# Altium project FC_Ver_0_1.PrjPcb
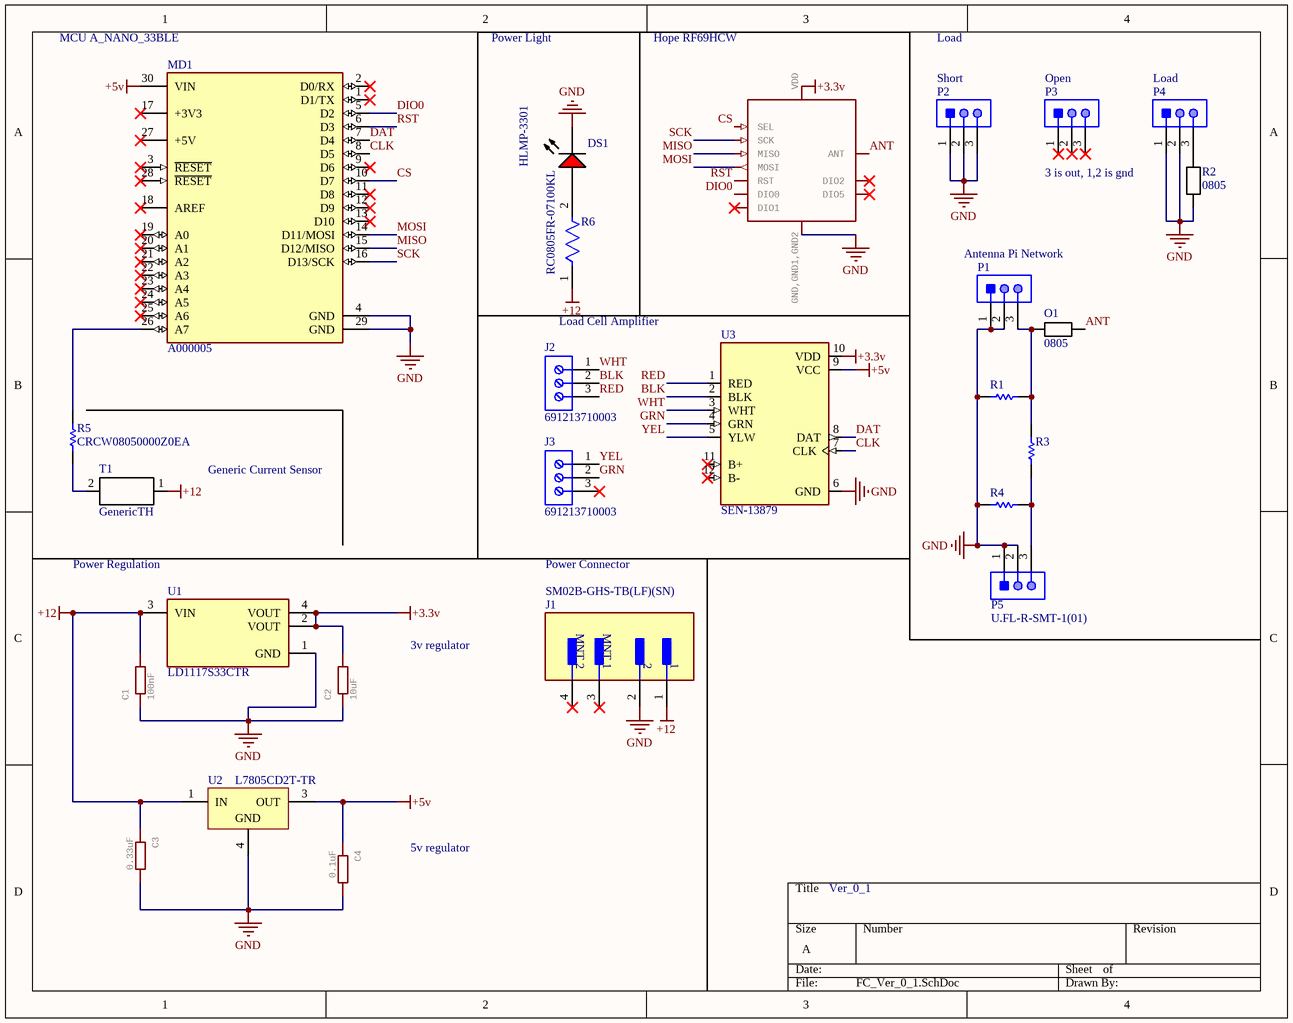
[diagram p0: FC_Ver_0_1.SchDoc]
1 sheet, 26 parts. Net scope: global (net labels, ports and power ports of the same name join across sheets).
Board file: FC_Ver_0_1.PcbDoc

## Sheet FC_Ver_0_1.SchDoc
size A; SheetNumber: 1; SheetTotal: 1

### Parts
1  _C2H_RFM95  [_C2H_RFM95]  (value not drawn)
C1  100nF  [RCL_M0805]
C2  10uF  [RCL_M0805]
C3  0.33uF  [RCL_M0805]
C4  0.1uF  [RCL_M0805]
DS1  HLMP-3301  [AVAG-HLMP-3301-2]
J1  SM02B-GHS-TB(LF)(SN)  [FP-SM02B-GHS-TB_LF_SN-MFG]
J2  691213710003  [691213710003]
J3  691213710003  [691213710003]
MD1  A000005  [FP-A000005-MFG]
O1  0805  [RESC2012X06N]
P1  U.FL-R-SMT-1(01)  [HRS-U.FL-R-SMT-3_V]  (value not drawn)
P2  Short  [HRS-U.FL-R-SMT-3_V]
P3  Open  [HRS-U.FL-R-SMT-3_V]
P4  Load  [HRS-U.FL-R-SMT-3_V]
P5  U.FL-R-SMT-1(01)  [HRS-U.FL-R-SMT-3_V]
R1  RC0805FR-071KL  [RESC2013X60X35ML10T20]  (value not drawn)
R2  0805  [RESC2012X06N]
R3  RC0805FR-071KL  [RESC2013X60X35ML10T20]  (value not drawn)
R4  RC0805FR-071KL  [RESC2013X60X35ML10T20]  (value not drawn)
R5  CRCW08050000Z0EA  [RESC2013X50X30LL20T20]
R6  RC0805FR-07100KL  [FP-RC0805-0_6-IPC_C]
T1  GenericTH  [Generic Two Pin Connector]
U1  LD1117S33CTR  [FP-SOT-223-0046067_14-MFG]
U2  L7805CD2T-TR  [TO-263_M]
U3  SEN-13879  [SPARKFUN_SEN-13879]

### Nets
+3.3v: 1.VDD(VCC) C2.2 U1.2(VOUT) U1.4(VOUT) U3.10(VDD)
+5v: C4.1 MD1.30(VIN) U2.3(OUT) U3.9(VCC)
+12: C1.2 C3.1 J1.1 R6.1 T1.1 U1.3(VIN) U2.1(IN)
GND: 1.GND,GND1,GND2(GND) C1.1 C2.1 C3.2 C4.2 DS1.1(K) J1.2 MD1.4(GND) MD1.29(GND) P1.1 P1.2 P2.1 P2.2 P2.3 P4.1 P4.2 P5.1 P5.2 R1.2 R2.1 R4.1 U1.1(GND) U2.4(GND) U3.6(GND)
ANT: 1.ANT O1.2
BLK: J2.2 U3.2(BLK)
CLK: MD1.8(D5) U3.7(CLK)
CS: 1.NSS(SEL) MD1.10(D7)
DAT: MD1.7(D4) U3.8(DAT)
DIO0: 1.DIO0 MD1.5(D2)
GRN: J3.2 U3.4(GRN)
MISO: 1.MISO MD1.15(D12/MISO)
MOSI: 1.MOSI MD1.14(D11/MOSI)
RED: J2.3 U3.1(RED)
RST: 1.RST MD1.6(D3)
SCK: 1.SCK MD1.16(D13/SCK)
WHT: J2.1 U3.3(WHT)
YEL: J3.1 U3.5(YLW)
NetDS1_2: DS1.2(A) R6.2
NetMD1_26: MD1.26(A7) R5.1
NetO1_1: O1.1 P1.3 R1.1 R3.2
NetP4_3: P4.3 R2.2
NetP5_3: P5.3 R3.1 R4.2
NetR5_2: R5.2 T1.2

Not connected (* = marked no-connect by the designer): 1 DIO1* DIO2* DIO5*; J1 3(MNT_1)* 4(MNT_2)*; J3 3*; MD1 1(D1/TX)* 2(D0/RX)* 3(~{RESET})* 9(D6)* 11(D8)* 12(D9)* 13(D10)* 17(+3V3)* 18(AREF)* 19(A0)* 20(A1)* 21(A2)* 22(A3)* 23(A4)* 24(A5)* 25(A6)* 27(+5V)* 28(~{RESET})*; P3 1* 2* 3*; U3 11(B+)* 12(B-)*

### Notes on the sheet
- (near MD1) MCU A_NANO_33BLE
- Power Light
- Hope RF69HCW
- Load
- 3 is out, 1,2 is gnd
- (near P1) Antenna Pi Network
- Load Cell Amplifier
- Generic Current Sensor
- (near U1) Power Regulation
- Power Connector
- 3v regulator
- 5v regulator
- Ver_0_1

### Library data of the parts
1 = _C2H_RFM95: GateName_1: G$1; SymbolName_1: _C2H_RFM95; LibraryName: AmbaSat-1v1-01-NO-solar; DeviceSetName: _C2H_RFM95; Package: _C2H_RFM95
C1-C4 = RCL_R-EU_M0805: GateName_1: G$1; DeviceName: M0805; SymbolName_1: RCL_R-EU; LibraryName: AmbaSat-1v1-01-NO-solar; DeviceSetName: RCL_R-EU_; Package: RCL_M0805
DS1 = CMP-2000-06411-1: T-1 3/4 (5 mm) Diffused LED Lamp, 1.9 V, -40 to 100 degC, 2-Pin THD, RoHS, Bulk; Manufacturer: Avago; Forward Current: 25mA; Forward Voltage: 2.4V; Peak Wavelength: 635nm; Shape Type: Circular; High Brightness: No; Main Category: StandardLED; Test Current (It): 10mA; Dominant Wave Length: 626nm; Number of  Elements: 1; Reverse Voltage: 5V; Chip Material: GaP; Product Height (mm): 9.19mm; Lens Type: ColoredDiffused; Viewing Angle: 60deg; Type: Uni-Color; Emitting Color: Red; Luminous Intensity: 5.4mcd; Power Dissipation: 85W; DELETED: Compliant; Product Depth (mm): 6.1mm; Package Description: 2-Pin Through Hole LED, Dia 5.85 mm; Mounting Technology: ThroughHole; Manufacturer URL: http://www.avagotech.com/; Package Type: T-13/4; Operating Temp Range: -40Cto100C; Datasheet URL: http://www.avagotech.com/docs/AV02-1558EN; Mounting: ThroughHole; Lens Dimensions: 5.08x5.08x8.3mm; Package Reference: HLMP-3301; Datasheet Version: 03/2015; Pin Count: 2; Packaging: TapeandReel; Operating Temperature Classification: Industrial; Lum Intensity: 5.4mcd; Rad Hardened: No; Product Length (mm): 6.1mm
J1 = CMP-2000-07076-2: CONN HEADER SMD R/A 2POS 1.25MM; Voltage Rating: 50V; Number of Positions: 2; Pitch: 0.049inch; Current Rating: 1A; Connector Type: Outer Shroud Contact; Number of Rows: 1; Contact Material: Bronze; Termination: Solder; Color: Natural; Package Quantity: 2500; Mount: Surface Mount; Housing Color: Natural; Number of Contacts: 2; Packaging: Tape and Reel; Lead Free: Lead Free; Housing Material: Nylon; Orientation: Right Angle; Contact Type: Male Pin; Contact Plating: Tin; Series: GH; Fastening Type: Latch
J2 J3 = CMP-1502-02527-2: NexarPartId: 8917719; Number of Contacts: 3; Wire/Cable Gauge: 16AWG; Wire Gauge (Max): 26AWG; Connector Type: PCB, Terminal Block; Number of Levels: 1; Plating: Brass, Steel; Current: 10A; Voltage: 300V; Stripping Length: -7mm; Pitch: 5.0038mm; REACH SVHC: Unknown; Mount: Through Hole; Max Operating Temperature: 105°C; Contact Plating: Tin; Termination: Screw; Contact Material: Brass; Housing Material: Nylon; Color: Green; RoHS: Compliant; Wire Gauge (Min): 16AWG; Min Operating Temperature: -40°C; Length: 8.3mm; Packaging: Box; Number of Pins: 3; Lead Pitch: 5mm; Number of Positions Per Level: 3; Height: 10mm; Width: 15.6mm
MD1 = CMP-189986-000002-1: ARDUINO NANO ATMEGA328 EVAL BRD; Number of Bits: 8; Evaluation Kit: Yes; Operating Supply Voltage: 12V; Interface: I2C; Data Bus Width: 8b; Core Architecture: AVR; Packaging: Bulk; Length: 7inch; Package Quantity: 50; Width: 5inch; REACH SVHC: No SVHC; Weight: 0.358383oz; Series: AVR® ATmega; Height: 0.25inch
P1-P5 = CMP-2000-05153-1: Ultra Small Coaxial Connector, 6 GHz, -40 to 90 degC, 3-Pin SMD, RoHS, Bulk; Manufacturer: Hirose Electric; Connector Style: U.FL; Impedance: 50Ohm; Dielectric Material: LiquidCrystalPolymer(LCP); Minimum Quantity: UltraMiniatureCoaxial; Online Catalog: U.FLSeries; Featured Product: HiroseU.FLSeries; Frequency - Max: 6GHz; Other Names: H122041 / U.FL-R-SMT-1(01)-ND; Contact Termination: Solder; Body Material: PhosphorBronze; Connector Type: Jack,MalePin; Body Finish: Silver; Center Contact Plating: Gold; Manufacturer URL: https://www.hirose.com; Family: CoaxialConnectors(RF); Fastening Type: Snap-On; Unit PriceUSD: U.FL; Series: U.FL; Package Reference: U.FL-R-SMT; Packaging: Bulk; Standard Package: 100; Mounting Type: SurfaceMount; Quantity Available: Bulk; Housing Color: Silver; Package Description: 3-Pin Surface Mount Device, Body 2.6 x 2.6 mm; Category: Connectors,Interconnects; Operating Temperature: -40degC~90degC; Center Contact Material: PhosphorBronze; Dynamic Catalog: U.FLSeries; Datasheet URL: https://datasheet.ciiva.com/26945/getdatasheetpartid-475239-26945414.pdf; Datasheet Version: Feb-09; Shield Termination: Solder
R1 R3 R4 = CMP-2100-03671-1: Chip Resistor, 1 KOhm, +/- 1%, 125 mW, -55 to 155 degC, 0805 (2012 Metric), RoHS, Tape and Reel; Manufacturer: Yageo; Temperature Coefficient: 100ppm/degreesC; Voltage Rating (DC): 150V; Max Power Dissipation: 125mW; Resistance: 1KOhm; Number of Pins: 2; Number of Terminations: 2; Datasheet URL: http://www.yageo.com/NewPortal/yageodocoutput?fileName=/pdf/R-Chip/PYu-RC_Group_51_RoHS_L_5.pdf; Length: 0.079inch; Package Description: 2-Pin Surface Mounted Device, Body 2 x 1.25 mm; Depth: 1.25mm; Height: 0.024inch; Military Standard: Not; Case/Package: 0805; Package Reference: 0805; RoHSCompliant: true; Lead Free: LeadFree; Packaging: TapeandReel; Package Quantity: 1; Datasheet Version: Rev. 5, 10/2016; Tolerance: 1%; Min Operating Temperature: -55degC; Voltage Rating: 150V; Composition: ThickFilm; Case Code (Imperial): 0805; Power Rating: 125mW; Width: 0.049inch; Case Code (Metric): 2012; Manufacturer URL: http://www.yageo.com/; Max Operating Temperature: 155degC; REACH SVHC: Unknown; Termination: SMD/SMT
R5 = CMP-2001-04896-1: Manufacturer: Vishay Dale; Part Number: CRCW08050000Z0EA
R6 = CMP-2100-03668-5: RES 100K OHM 1% 1/8W 0805; Power Rating: 125mW; Temperature Coefficient: 100ppm/°C; Voltage Rating (DC): 150V; Resistance: 100kR; Package Quantity: 1; Case/Package: 0805; Lead Pitch: 0.4mm; Case Code (Imperial): 0805; Construction: Rectangular; Number of Terminations: 2; RoHS Compliant: Yes; Max Power Dissipation: 125mW; Tolerance: 1%; Max Operating Temperature: 155°C; Resistance Tolerance: 1%; Lead Free: Lead Free; Packaging: Tape and Reel; Resistor Type: Thick Film; Min Operating Temperature: -55°C; Case Code (Metric): 2012; Series: RC; Technology: THICK FILM; Voltage Rating: 150V; Termination: SMD/SMT; Width: 0.049inch; Number of Pins: 2; Features: Moisture Resistant; Military Standard: Not; Length: 0.079inch; Depth: 1.25mm; Size Code: 0805; Height: 0.024inch
T1 = Generic Through Hole
U1 = CMP-0244-00307-2: IC REG LINEAR 3.3V 800MA SOT223; Input Bias Current: 5mA; Output Voltage Accuracy: 1%; Dropout Voltage: 1.1V; Power Dissipation: 12W; Polarity: Positive; Min Input Voltage: 5.3V; Quiescent Current: 10mA; Max Output Current: 1.3A; Output Current: 950mA; Number of Regulators: 1; Max Supply Voltage: 15V; Output Type: Fixed; Output Voltage: 3.3V; Number of Terminals: 4; Min Supply Voltage: 3.3V; Termination: SMD/SMT; Mount: Surface Mount; Max Power Dissipation: 12W; Case/Package: SOT-223; Lead Free: Lead Free; Height: 1.8mm; REACH SVHC: No SVHC; Radiation Hardening: No; Width: 3.5mm; Length: 6.5mm; Packaging: Tape and Reel; Max Input Voltage: 15V; Accuracy: 1%; Weight: 0.01lb; Contact Plating: Tin; Max Operating Temperature: 125°C; Number of Pins: 4; Max Output Voltage: 3.3V; Min Operating Temperature: -40°C; Nominal Output Voltage: 3.3V; Package Quantity: 1; Min Output Voltage: 3.3V; Number of Outputs: 1
U2 = CMP-0244-00213-1: Positive Voltage Regulator, 3-Pin D2PAK, Tape and Reel; PackageReference: TO-263; ComponentLink2URL: http://www.st.com/internet/com/TECHNICAL_RESOURCES/TECHNICAL_LITERATURE/DATASHEET/CD00000444.pdf; PackageDescription: 3-Pin Transistor Outline Package 2.54 mm Pitch, 15.4 mm Lead Span (D2PAK); DatasheetVersion: 16/11/2011; ComponentLink2Description: Datasheet; ComponentLink1Description: Manufacturer URL; PackageVersion: 2011; ComponentLink1URL: http://www.st.com
U3 = SEN-13879: Load Cell Amp Hx711; Package: None; MP: SEN-13879; Price: None; Availability: Unavailable; Value: *